# Altium schematic sheet DAQ_IO.SchDoc: DAQ I/O + protection
size A4; Date: 6.4.2015; Engineer: Matjaž Tome; DocumentNumber: 5; Revision: B; SheetNumber: 6; SheetTotal: 10; Project: USB DAQ
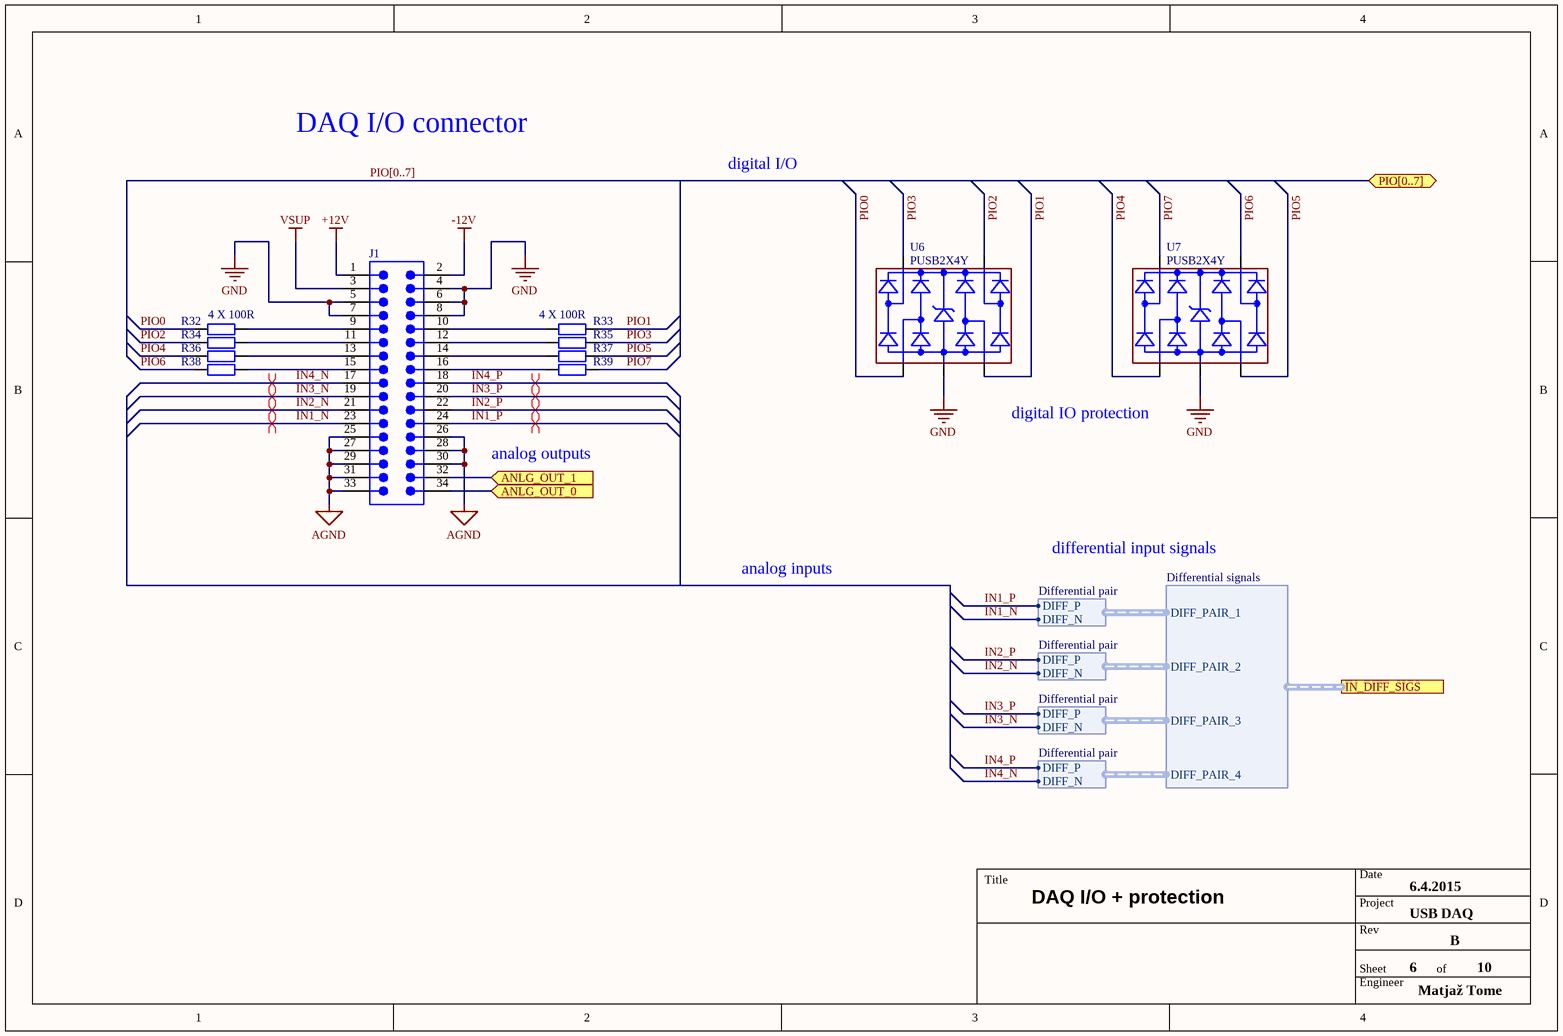
[diagram p0: DAQ_IO.SchDoc]

## Parts
J1  2X17  [IDC34R]  (value not drawn)
R32  100R  [R_0603]  (value not drawn)
R33  100R  [R_0603]  (value not drawn)
R34  100R  [R_0603]  (value not drawn)
R35  100R  [R_0603]  (value not drawn)
R36  100R  [R_0603]  (value not drawn)
R37  100R  [R_0603]  (value not drawn)
R38  100R  [R_0603]  (value not drawn)
R39  100R  [R_0603]  (value not drawn)
U6  PUSB2X4Y  [SOT363]
U7  PUSB2X4Y  [SOT363]

## Ports
ANLG_OUT_0 (in), ANLG_OUT_1 (in), IN_DIFF_SIGS (harness Differential signals), PIO[0..7] (bidir)

## Harnesses
Differential pair: DIFF_P, DIFF_N
Differential signals: DIFF_PAIR_1, DIFF_PAIR_2, DIFF_PAIR_3, DIFF_PAIR_4

## Nets
+12V: J1.1
-12V: J1.2
AGND: J1.25 J1.26 J1.27 J1.28 J1.29 J1.30 J1.31 J1.33
GND: J1.4 J1.5 J1.6 J1.7 J1.8 U6.2 U7.2
VSUP: J1.3
ANLG_OUT_0: J1.34 ; port ANLG_OUT_0
ANLG_OUT_1: J1.32 ; port ANLG_OUT_1
IN1_N: J1.23 ; harness Differential pair.DIFF_N
IN1_P: J1.24 ; harness Differential pair.DIFF_P
IN2_N: J1.21 ; harness Differential pair.DIFF_N
IN2_P: J1.22 ; harness Differential pair.DIFF_P
IN3_N: J1.19 ; harness Differential pair.DIFF_N
IN3_P: J1.20 ; harness Differential pair.DIFF_P
IN4_N: J1.17 ; harness Differential pair.DIFF_N
IN4_P: J1.18 ; harness Differential pair.DIFF_P
PIO0: R32.1 U6.1
PIO1: R33.2 U6.3
PIO2: R34.1 U6.4
PIO3: R35.2 U6.6
PIO4: R36.1 U7.1
PIO5: R37.2 U7.3
PIO6: R38.1 U7.4
PIO7: R39.2 U7.6
NetJ1_9: J1.9 R32.2
NetJ1_10: J1.10 R33.1
NetJ1_11: J1.11 R34.2
NetJ1_12: J1.12 R35.1
NetJ1_13: J1.13 R36.2
NetJ1_14: J1.14 R37.1
NetJ1_15: J1.15 R38.2
NetJ1_16: J1.16 R39.1

## Buses and harness runs
bus PIO[0..7] = port PIO[0..7]

## Layout directives
differential pair: IN1_N, IN1_P, IN2_N, IN2_P, IN3_N, IN3_P, IN4_N, IN4_P

## Notes on the sheet
- DAQ I/O connector
- digital I/O
- (near R32) 4 X 100R
- (near R33) 4 X 100R
- digital IO protection
- analog outputs
- analog inputs
- differential input signals
- Title
- Date
- Project
- Rev
- Engineer
- Sheet
- of

## Library data of the parts
J1 = 09 18 534 7323: Pin Header, Right Angle, Wire-to-Board, 2.54 mm, 2 Rows, 34 Contacts, Through Hole Right Angle; Manufacturer: Harting; Dealer number: 1106736; Dealer: Farnell; Pitch: 2.54mm; Lenght: 2.9mm; Strain Reliefe: no; Category: Connectors; Price: 2.26; Manufacturer Number: 09 18 534 7323; Pins: 34; Orientation: right angle; Technology: THT; HelpURL: https://www.farnell.com/datasheets/2012759.pdf
R32-R39 = Resistor: Generic resistor; Value: 100R
U6 U7 = PUSB2X4Y: ESD protection for high-speed interfaces; Part Number: XDE0000; Manufacturer: Multicomp; Dealer number: 2400968; Dealer: Farnell; Clamping voltage: 3.8V; Category: diode array; Price: 0.174; Manufacturer Number: PUSB2X4Y; Case: SOT363; Technology: SMT; HelpURL: https://www.farnell.com/datasheets/1801208.pdf